# EAGLE design PALFromPerl (EAGLE 6.6.0)
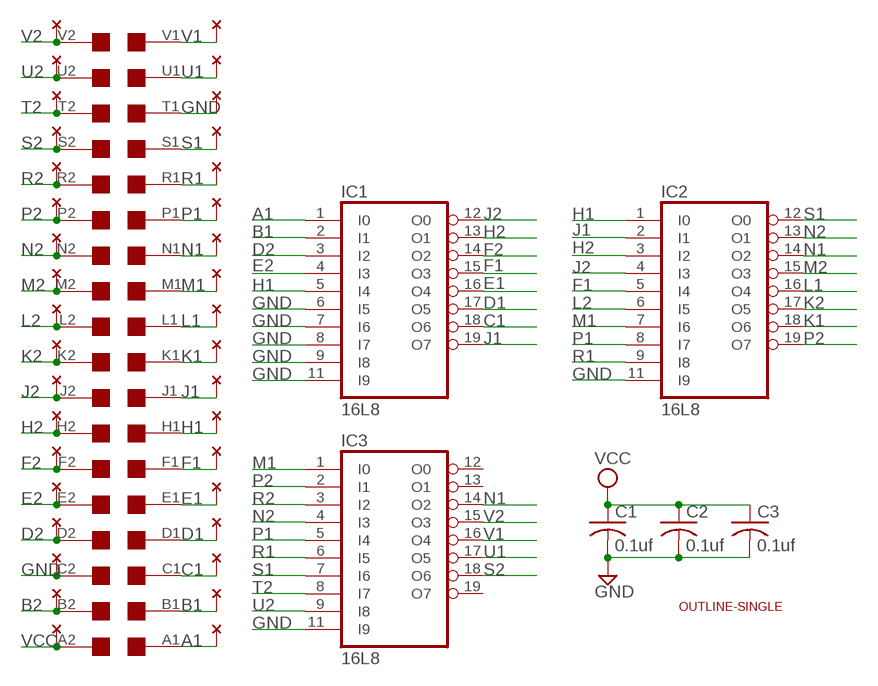
[diagram p0: schematic, sheet 1]

## Parts
C1  0.1uf  C-US050-025X075  [C050-025X075]
C2  0.1uf  C-US050-025X075  [C050-025X075]
C3  0.1uf  C-US050-025X075  [C050-025X075]
IC1  16L8  [DIL20]
IC2  16L8  [DIL20]
IC3  16L8  [DIL20]
U$1  EDGE-2CONNECTOR  [EDGE-CON2]
U$2  OUTLINE-SINGLE  [SINGLE]
U$4  THRU-HOLE2A  [THRU-HOLEA]

## Nets
A1: IC1.1(I0) U$1.A1 U$4.A1
B1: IC1.2(I1) U$1.B1 U$4.B1
B2: U$1.B2 U$4.B2
C1: IC1.18(O6) U$1.C1 U$4.C1
D1: IC1.17(O5) U$1.D1 U$4.D1
D2: IC1.3(I2) U$1.D2 U$4.D2
E1: IC1.16(O4) U$1.E1 U$4.E1
E2: IC1.4(I3) U$1.E2 U$4.E2
F1: IC1.15(O3) IC2.5(I4) U$1.F1 U$4.F1
F2: IC1.14(O2) U$1.F2 U$4.F2
GND: C1.2 C2.2 C3.2 IC1.6(I5) IC1.7(I6) IC1.8(I7) IC1.9(I8) IC1.11(I9) IC2.11(I9) IC3.11(I9) U$1.C2 U$1.T1 U$4.C2 U$4.T1
H1: IC1.5(I4) IC2.1(I0) U$1.H1 U$4.H1
H2: IC1.13(O1) IC2.3(I2) U$1.H2 U$4.H2
J1: IC1.19(O7) IC2.2(I1) U$1.J1 U$4.J1
J2: IC1.12(O0) IC2.4(I3) U$1.J2 U$4.J2
K1: IC2.18(O6) U$1.K1 U$4.K1
K2: IC2.17(O5) U$1.K2 U$4.K2
L1: IC2.16(O4) U$1.L1 U$4.L1
L2: IC2.6(I5) U$1.L2 U$4.L2
M1: IC2.7(I6) IC3.1(I0) U$1.M1 U$4.M1
M2: IC2.15(O3) U$1.M2 U$4.M2
N1: IC2.14(O2) IC3.14(O2) U$1.N1 U$4.N1
N2: IC2.13(O1) IC3.4(I3) U$1.N2 U$4.N2
P1: IC2.8(I7) IC3.5(I4) U$1.P1 U$4.P1
P2: IC2.19(O7) IC3.2(I1) U$1.P2 U$4.P2
R1: IC2.9(I8) IC3.6(I5) U$1.R1 U$4.R1
R2: IC3.3(I2) U$1.R2 U$4.R2
S1: IC2.12(O0) IC3.7(I6) U$1.S1 U$4.S1
S2: IC3.18(O6) U$1.S2 U$4.S2
T2: IC3.8(I7) U$1.T2 U$4.T2
U1: IC3.17(O5) U$1.U1 U$4.U1
U2: IC3.9(I8) U$1.U2 U$4.U2
V1: IC3.16(O4) U$1.V1 U$4.V1
V2: IC3.15(O3) U$1.V2 U$4.V2
VCC: C1.1 C2.1 C3.1 U$1.A2 U$4.A2
Unconnected: IC3.12(O0) IC3.13(O1) IC3.19(O7)

## Power pins joined to a net without a drawn wire
GND: IC1.10(GND) IC2.10(GND) IC3.10(GND)
VCC: IC1.20(VCC) IC2.20(VCC) IC3.20(VCC)

## Library data of the parts
C1-C3 = rcl:C-US: CAPACITOR, American symbol
IC1-IC3 = pal:16L8: PAL; MF: TEXAS INSTRUMENTS; MPN: TIBPAL16L8-7CN; OC_FARNELL: 1510033; OC_NEWARK: 08F8522
U$1 = dec-con:EDGE-2: Double-Sided DEC edge connector.
U$2 = dec-con:OUTLINE-*: Board outlines for DEC boards.
U$4 = dec-con:THRU-HOLE2: Thru-Hole addition to double-sided edge connector.

## Board
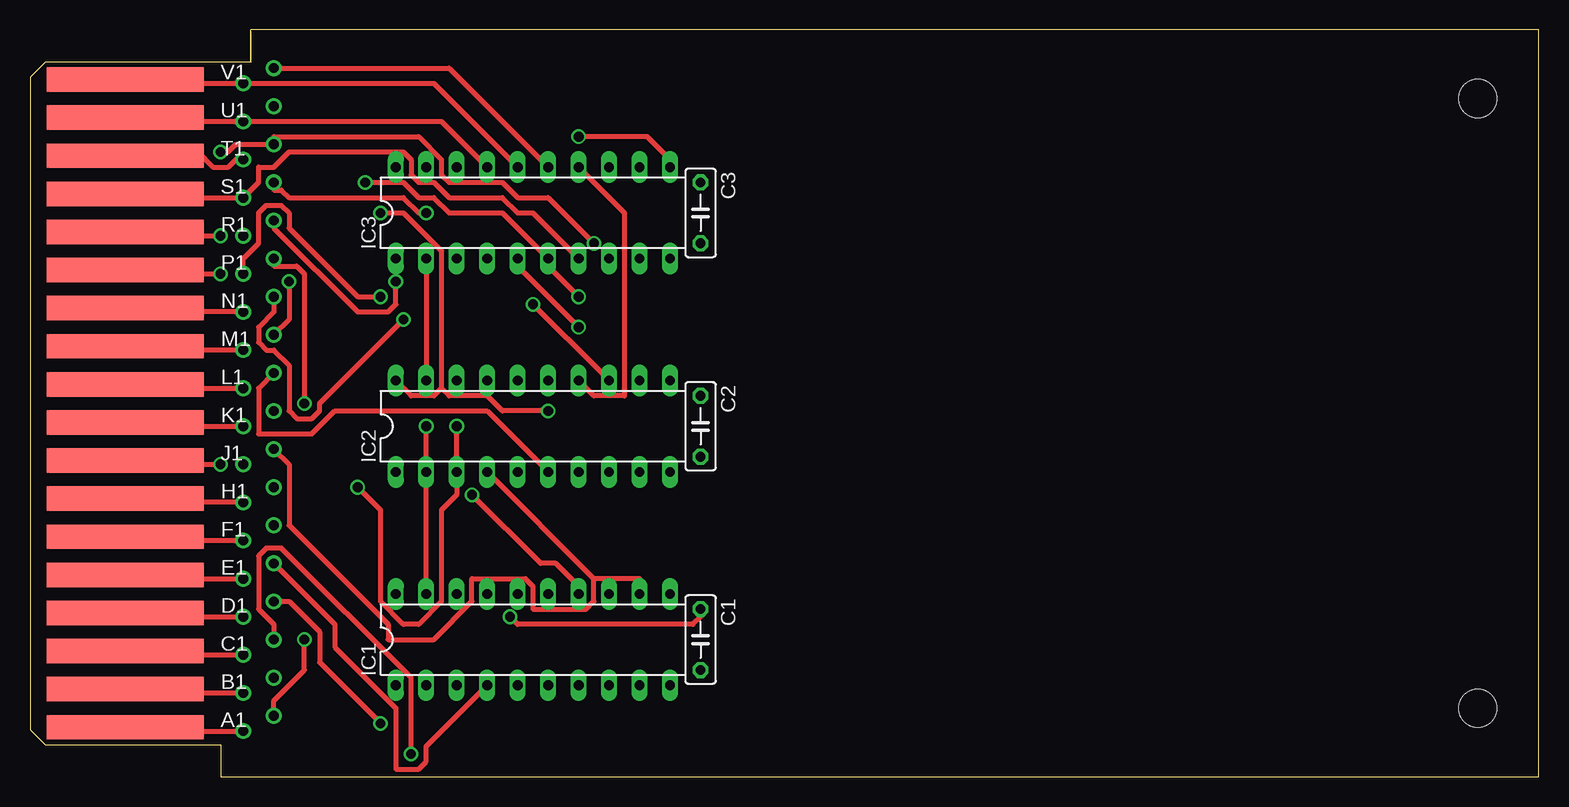
[diagram p1: board, top side]
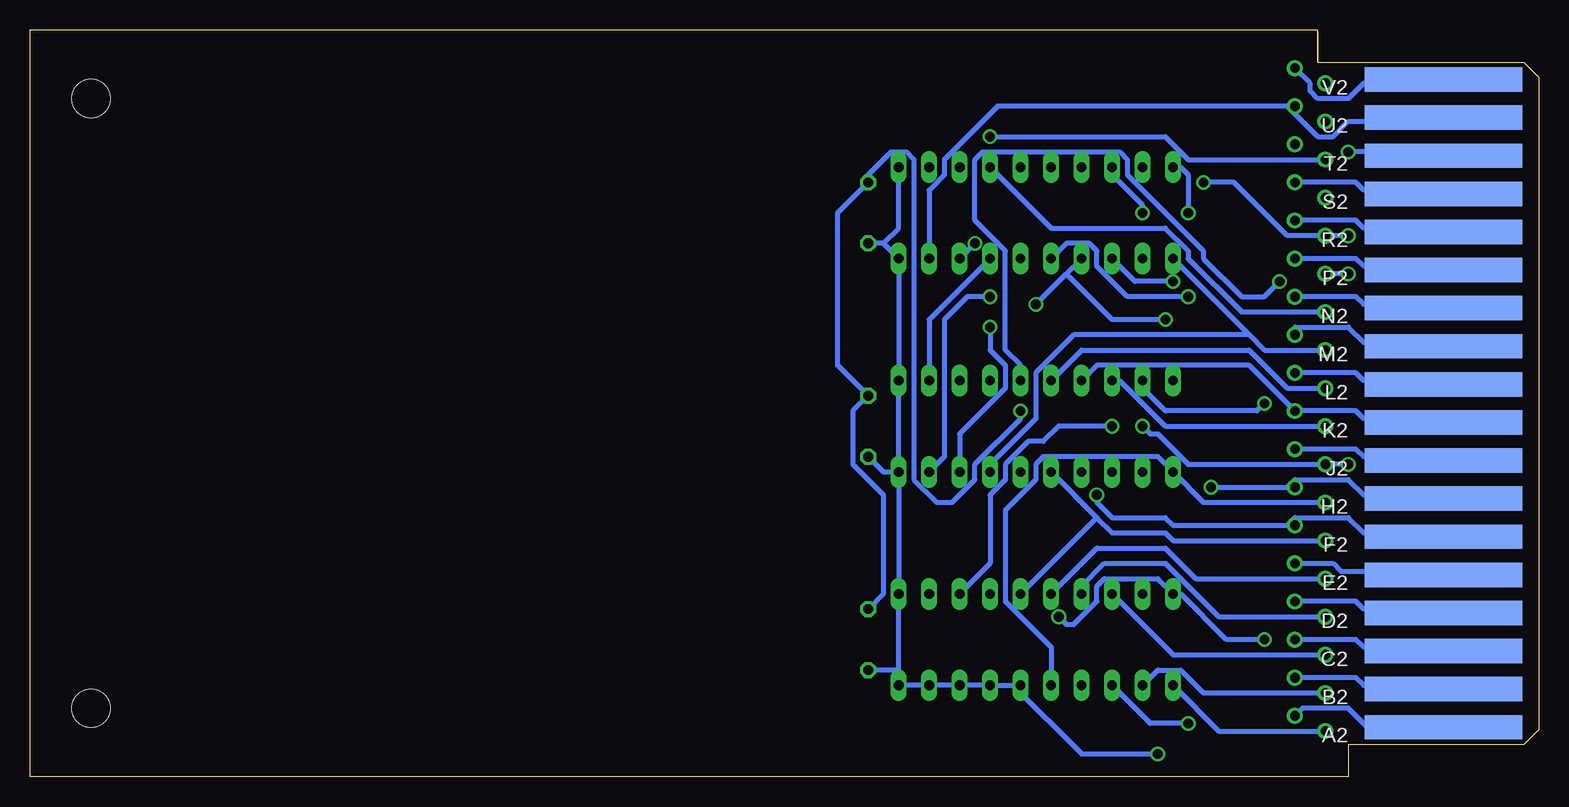
[diagram p2: board, bottom side, seen from below]

Size 125.73 x 62.23 mm. Coordinates in mm from the lower left corner, seen from the top.
Copper layers (1+16): Top 0.035mm / dielectric 1.5mm / Bottom 0.035mm
Design rules "16mils": minimum track width 16mil, minimum drill 32mil, track to track 15mil, track to pad 10mil, pad to pad 10mil, via to via 10mil, smd to smd 10mil, copper to edge 13mil, drill to drill 10mil, minimum pad ring 10mil, minimum via ring 8mil, stop-mask expansion 0mil, vias tented up to drill 0mil, thermal gap 10mil

### Footprints (pad centres in the part's own frame; a part is rotated, then mirrored left to right if it is on the bottom)
C050-025X075 = drill 0.813 octagon: 1 -2.54,0; 2 2.54,0
DIL20 = drill 0.813 long: 1 -11.43,-3.81; 2 -8.89,-3.81; 3 -6.35,-3.81; 4 -3.81,-3.81; 5 -1.27,-3.81; 6 1.27,-3.81; 7 3.81,-3.81; 8 6.35,-3.81; 9 8.89,-3.81; 10 11.43,-3.81; 11 11.43,3.81; 12 8.89,3.81; 13 6.35,3.81; 14 3.81,3.81; 15 1.27,3.81; 16 -1.27,3.81; 17 -3.81,3.81; 18 -6.35,3.81; 19 -8.89,3.81; 20 -11.43,3.81
EDGE-CON2 = smd 13.106 x 2.032: A1 7.938,4.128; B1 7.938,7.303; C1 7.938,10.477; D1 7.938,13.652; E1 7.938,16.828; F1 7.938,20.003; H1 7.938,23.177; J1 7.938,26.352; K1 7.938,29.527; L1 7.938,32.703; M1 7.938,35.877; N1 7.938,39.053; P1 7.938,42.227; R1 7.938,45.403; S1 7.938,48.578; T1 7.938,51.752; U1 7.938,54.928; V1 7.938,58.102 | smd 13.106 x 2.032 bottom: A2 7.938,4.128; B2 7.938,7.303; C2 7.938,10.477; D2 7.938,13.652; E2 7.938,16.828; F2 7.938,20.003; H2 7.938,23.177; J2 7.938,26.352; K2 7.938,29.527; L2 7.938,32.703; M2 7.938,35.877; N2 7.938,39.053; P2 7.938,42.227; R2 7.938,45.403; S2 7.938,48.578; T2 7.938,51.752; U2 7.938,54.928; V2 7.938,58.102
SINGLE = hole 3.175: 120.65,56.515; 120.65,5.715
THRU-HOLEA = drill 0.813 pad 1.27: A1 17.78,3.81; A2 20.32,5.08; B1 17.78,6.985; B2 20.32,8.255; C1 17.78,10.16; C2 20.32,11.43; D1 17.78,13.335; D2 20.32,14.605; E1 17.78,16.51; E2 20.32,17.78; F1 17.78,19.685; F2 20.32,20.955; H1 17.78,22.86; H2 20.32,24.13; J1 17.78,26.035; J2 20.32,27.305; K1 17.78,29.21; K2 20.32,30.48; L1 17.78,32.385; L2 20.32,33.655; M1 17.78,35.56; M2 20.32,36.83; N1 17.78,38.735; N2 20.32,40.005; P1 17.78,41.91; P2 20.32,43.18; R1 17.78,45.085; R2 20.32,46.355; S1 17.78,48.26; S2 20.32,49.53; T1 17.78,51.435; T2 20.32,52.705; U1 17.78,54.61; U2 20.32,55.88; V1 17.78,57.785; V2 20.32,59.055

### Placement (x,y rotation side)
C1  55.88,11.43 270 top
C2  55.88,29.21 270 top
C3  55.88,46.99 270 top
IC1  41.91,11.43 0 top
IC2  41.91,29.21 0 top
IC3  41.91,46.99 0 top
U$1  0,0 0 top
U$2  0,0 0 top
U$4  0,0 0 top

### Tracks (layer width: path | path; a pad name or v marks a point on that pad's centre or on a via)
A1
  Top 0.406: U$4.A1 8.26,3.81 U$1.A1
  Bottom 0.406: U$4.A1 26.67,3.81 IC1.1
B1
  Top 0.406: U$4.B1 8.26,6.99 U$1.B1
  Bottom 0.406: U$4.B1 27.94,6.99 29.85,8.89 31.75,8.89 IC1.2
B2
  Bottom 0.406: U$4.B2 15.24,8.26 14.61,7.62 8.26,7.62 U$1.B2
C1
  Top 0.406: U$4.C1 8.26,10.16 U$1.C1
  Bottom 0.406: U$4.C1 30.48,10.16 IC1.18
D1
  Top 0.406: U$4.D1 8.26,13.34 U$1.D1
  Bottom 0.406: U$4.D1 26.67,13.34 31.12,17.78 36.2,17.78 38.1,15.88 IC1.17
D2  (via drill 0.81)
  Top 0.406: v29.21,4.45 24.13,9.53 24.13,12.06 21.59,14.61 U$4.D2
  Bottom 0.406: U$4.D2 15.24,14.61 14.61,13.97 8.26,13.97 U$1.D2 | IC1.3 32.39,4.45 v29.21,4.45
E1
  Top 0.406: U$4.E1 8.26,16.51 U$1.E1
  Bottom 0.406: U$4.E1 28.58,16.51 31.12,19.05 36.83,19.05 IC1.16
E2
  Top 0.406: IC1.4 33.02,2.54 33.02,1.27 32.39,0.64 30.48,0.64 30.48,5.71 25.4,10.79 25.4,12.7 U$4.E2
  Bottom 0.406: U$4.E2 17.15,17.78 16.51,17.14 8.26,17.14 U$1.E2
F1
  Top 0.406: U$4.F1 8.26,19.68 U$1.F1
  Bottom 0.406: U$4.F1 30.48,19.68 31.12,20.32 35.56,20.32 36.83,21.59 | IC2.5 36.83,21.59 | 36.83,21.59 IC1.15
F2  (via drill 0.81)
  Top 0.406: v36.83,23.5 42.55,17.78 43.82,17.78 45.72,15.88 IC1.14
  Bottom 0.406: 20.96,20.95 30.48,20.95 31.12,21.59 35.56,21.59 36.83,22.86 v36.83,23.5 | 20.96,20.95 20.32,21.59 15.88,21.59 14.61,20.32 8.26,20.32 U$1.F2 | 20.96,20.95 U$4.F2
GND  (via drill 0.81)
  Top 0.406: U$4.T1 17.15,51.44 16.51,50.8 15.24,50.8 13.97,52.07 8.26,52.07 U$1.T1 | v45.72,53.34 51.44,53.34 53.34,51.44 IC3.11 | U$4.C2 20.32,12.7 19.05,13.97 19.05,18.41 19.69,19.05 20.96,19.05 31.75,8.26 v31.75,1.91
  Bottom 0.406: U$4.C2 15.24,11.43 14.61,10.79 8.26,10.79 U$1.C2 | 43.82,7.62 IC1.7 IC1.8 IC1.9 IC1.10 53.34,8.89 | 53.34,8.89 IC1.11 IC2.10 | 53.34,8.89 C1.2 | IC2.10 54.61,25.4 C2.2 | IC2.10 IC2.11 IC3.10 54.61,44.45 | 54.61,44.45 C3.2 | IC3.11 53.34,45.72 54.61,44.45 | U$4.T1 29.21,51.44 31.12,53.34 v45.72,53.34 | v31.75,1.91 38.1,1.91 43.82,7.62 | 43.82,7.62 IC1.6
H1
  Top 0.406: U$4.H1 8.26,22.86 U$1.H1
  Bottom 0.406: U$4.H1 27.94,22.86 IC2.1 31.75,26.67 41.28,26.67 41.91,26.04 41.91,24.77 44.45,22.23 44.45,14.61 40.64,10.79 IC1.5
H2  (via drill 0.81)
  Top 0.406: v27.31,24.13 29.21,22.23 29.21,14.61 31.12,12.7 32.39,12.7 34.29,14.61 34.29,22.23 35.56,23.5 IC2.3 v35.56,29.21
  Bottom 0.406: v27.31,24.13 20.96,24.13 | IC1.13 45.72,17.78 45.72,23.5 44.45,24.77 44.45,26.04 42.55,27.94 41.28,27.94 40.01,29.21 v35.56,29.21 | 20.96,24.13 20.32,24.77 15.88,24.77 14.61,23.5 8.26,23.5 U$1.H2 | 20.96,24.13 U$4.H2
J1  (via drill 0.81)
  Top 0.406: IC1.19 IC2.2 v33.02,29.21 | v15.88,26.04 12.07,26.04 11.43,26.67 8.26,26.67 U$1.J1
  Bottom 0.406: v33.02,29.21 32.39,28.57 31.75,28.57 29.21,26.04 U$4.J1 v15.88,26.04
J2
  Top 0.406: 46.99,16.51 IC2.4 | 46.99,16.51 50.8,16.51 IC1.12 | 46.99,16.51 46.99,14.61 46.36,13.97 41.91,13.97 41.91,15.88 41.28,16.51 36.83,16.51 36.83,14.61 33.66,11.43 29.85,11.43 29.85,12.7 21.59,20.95 21.59,26.04 U$4.J2
  Bottom 0.406: U$4.J2 15.24,27.3 14.61,26.67 8.26,26.67 U$1.J2
K1
  Top 0.406: U$4.K1 8.26,29.21 U$1.K1
  Bottom 0.406: U$4.K1 31.12,29.21 34.93,33.02 IC2.18
K2
  Bottom 0.406: U$1.K2 8.26,29.84 14.61,29.84 15.24,30.48 U$4.K2 24.13,34.29 36.83,34.29 IC2.17
L1
  Top 0.406: U$4.L1 8.26,32.38 U$1.L1
  Bottom 0.406: U$4.L1 20.96,32.38 24.13,35.56 38.1,35.56 IC2.16
L2
  Top 0.406: IC2.6 38.1,30.48 25.4,30.48 23.5,28.57 19.05,28.57 19.05,32.38 U$4.L2
  Bottom 0.406: U$4.L2 15.24,33.66 14.61,33.02 8.26,33.02 U$1.L2
M1
  Top 0.406: U$4.M1 8.26,35.56 U$1.M1
  Bottom 0.406: U$4.M1 22.86,35.56 24.13,36.83 | IC3.1 24.13,36.83 | IC2.7 45.72,26.04 41.91,29.84 41.91,33.66 38.74,36.83 24.13,36.83
M2  (via drill 0.81)
  Top 0.406: U$4.M2 21.59,38.1 v21.59,41.27
  Bottom 0.406: v21.59,41.27 22.86,40.01 24.77,40.01 27.94,43.18 27.94,43.81 34.29,50.16 34.29,51.44 34.93,52.07 46.36,52.07 46.99,51.44 46.99,46.35 44.45,43.81 44.45,35.56 43.18,34.29 IC2.15 | U$4.M2 20.32,37.47 15.88,37.47 14.61,36.2 8.26,36.2 U$1.M2
N1
  Top 0.406: IC2.14 46.99,31.75 49.53,31.75 49.53,46.99 IC3.14 | U$4.N1 8.26,38.73 U$1.N1
  Bottom 0.406: U$4.N1 24.77,38.73 29.21,43.18 29.21,43.81 31.12,45.72 40.64,45.72 IC3.14
N2  (via drill 0.81)
  Top 0.406: v41.91,39.37 47.63,33.66 48.26,33.66 IC2.13 | v31.12,38.1 24.13,31.11 24.13,30.48 23.5,29.84 22.23,29.84 21.59,30.48 21.59,34.29 20.32,35.56 19.69,35.56 19.05,36.2 19.05,37.47 20.32,38.73 U$4.N2
  Bottom 0.406: v41.91,39.37 39.37,41.91 | 39.37,41.91 IC3.4 | U$4.N2 15.24,40.01 14.61,39.37 8.26,39.37 U$1.N2 | 39.37,41.91 35.56,38.1 v31.12,38.1
P1  (via drill 0.81)
  Top 0.406: v45.72,37.47 40.64,42.55 IC3.5 | v15.88,41.91 12.07,41.91 11.43,42.55 8.26,42.55 U$1.P1 | v29.21,40.01 27.31,40.01 21.59,45.72 21.59,46.99 20.96,47.62 19.69,47.62 19.05,46.99 19.05,44.45 17.78,43.18 U$4.P1
  Bottom 0.406: IC2.8 48.26,28.57 44.45,32.38 44.45,34.29 45.72,35.56 v45.72,37.47 | v15.88,41.91 U$4.P1 | IC3.5 39.37,44.45 37.47,44.45 36.83,43.81 36.83,42.55 34.29,40.01 v29.21,40.01
P2  (via drill 0.81)
  Top 0.406: IC3.2 IC2.19 | v22.86,31.11 22.86,41.91 22.23,42.55 20.32,42.55 U$4.P2
  Bottom 0.406: U$4.P2 15.24,43.18 14.61,42.55 8.26,42.55 U$1.P2 | IC2.19 33.02,32.38 31.12,30.48 23.5,30.48 v22.86,31.11
R1  (via drill 0.81)
  Top 0.406: v45.72,40.01 43.18,42.55 IC3.6 39.37,46.99 34.93,46.99 33.66,48.26 32.39,48.26 31.12,49.53 v27.94,49.53 | v15.88,45.09 12.07,45.09 11.43,45.72 8.26,45.72 U$1.R1
  Bottom 0.406: IC2.9 49.53,26.67 49.53,38.1 47.63,40.01 v45.72,40.01 | v15.88,45.09 U$4.R1 20.96,45.09 25.4,49.53 v27.94,49.53
R2  (via drill 0.81)
  Top 0.406: v30.48,41.27 30.48,39.37 29.85,38.73 27.31,38.73 20.32,45.72 U$4.R2
  Bottom 0.406: U$4.R2 15.24,46.35 14.61,45.72 8.26,45.72 U$1.R2 | IC3.3 33.66,41.27 v30.48,41.27
S1
  Top 0.406: U$1.S1 8.26,48.26 U$4.S1 19.05,49.53 19.05,50.8 20.32,50.8 21.59,52.07 31.12,52.07 31.75,51.44 31.75,50.16 32.39,49.53 33.66,49.53 34.93,48.26 39.37,48.26 40.64,46.99 41.91,46.99 IC3.7
  Bottom 0.406: IC2.12 50.8,38.1 IC3.7
S2  (via drill 0.81)
  Top 0.406: v33.02,46.99 32.39,46.99 31.12,48.26 21.59,48.26 20.96,48.9 20.32,48.9 U$4.S2
  Bottom 0.406: U$4.S2 15.24,49.53 14.61,48.9 8.26,48.9 U$1.S2 | IC3.18 35.56,50.16 33.02,47.62 v33.02,46.99
T2  (via drill 0.81)
  Top 0.406: v15.88,52.07 16.51,52.07 17.15,52.7 U$4.T2 20.32,53.34 32.39,53.34 34.29,51.44 34.29,50.16 34.93,49.53 39.37,49.53 40.64,48.26 43.18,48.26 v46.99,44.45
  Bottom 0.406: v15.88,52.07 8.26,52.07 U$1.T2 | v46.99,44.45 IC3.8
U1
  Top 0.406: IC3.17 34.29,54.61 U$4.U1 8.26,54.61 U$1.U1
U2
  Bottom 0.406: IC3.9 50.8,48.9 49.53,50.16 49.53,51.44 45.09,55.88 20.96,55.88 | 20.96,55.88 18.42,53.34 17.15,53.34 15.88,54.61 8.26,54.61 U$1.U2 | 20.96,55.88 U$4.U2
V1
  Top 0.406: IC3.16 33.66,57.78 U$4.V1 8.26,57.78 U$1.V1
V2
  Top 0.406: IC3.15 34.93,59.05 U$4.V2
  Bottom 0.406: U$4.V2 19.05,57.78 19.05,57.15 18.42,56.52 15.88,56.52 14.61,57.78 8.26,57.78 U$1.V2
VCC  (via drill 0.81)
  Top 0.406: v22.86,11.43 22.86,8.89 20.32,6.35 U$4.A2 | IC2.20 31.75,31.75 33.66,31.75 34.29,32.38 | 34.29,32.38 34.29,43.81 31.12,46.99 v29.21,46.99 | 34.29,32.38 34.93,31.75 38.1,31.75 39.37,30.48 v43.18,30.48 | v40.01,13.34 40.64,12.7 55.25,12.7 55.88,13.34 C1.1
  Bottom 0.406: U$4.A2 19.69,5.71 15.88,5.71 13.97,3.81 10.16,3.81 9.53,4.45 8.26,4.45 U$1.A2 | v22.86,11.43 26.04,11.43 29.85,15.24 IC1.20 31.75,16.51 36.2,16.51 36.83,15.88 36.83,14.61 38.74,12.7 39.37,12.7 v40.01,13.34 | v29.21,46.99 29.21,50.16 29.85,50.8 IC3.20 | C1.1 54.61,15.24 54.61,23.5 57.15,26.04 57.15,30.48 C2.1 58.42,34.29 58.42,46.99 C3.1 55.88,50.16 53.98,52.07 52.71,52.07 52.07,51.44 52.07,24.77 50.17,22.86 48.9,22.86 46.99,24.77 46.99,26.04 43.18,29.84 v43.18,30.48